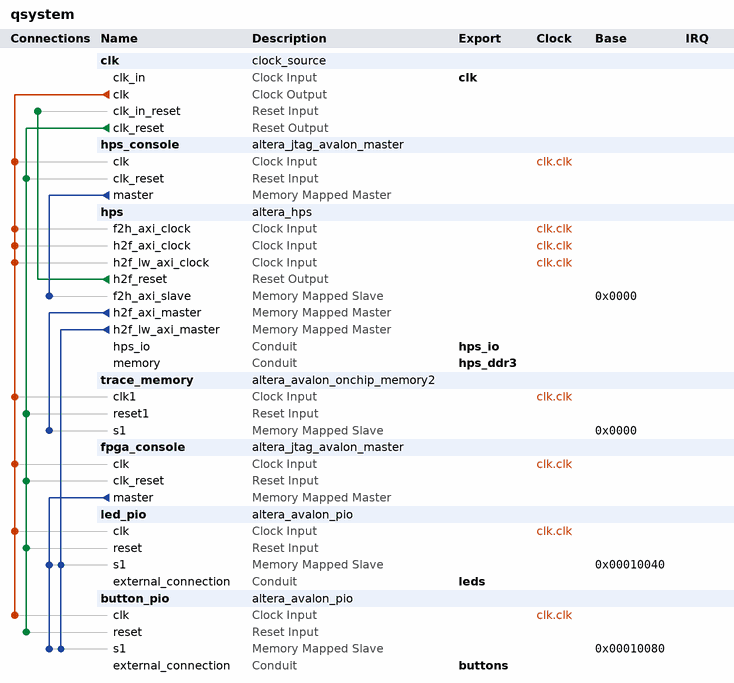
[diagram p0: system contents]
# Platform Designer (Qsys) system qsystem, Cyclone V 5CSXFC6C6U23C8ES
# Parameters at their usual value, and those the tool derives, are not listed.
package require -exact qsys 13.1
create_system qsystem
set_project_property DEVICE_FAMILY {Cyclone V}
set_project_property DEVICE 5CSXFC6C6U23C8ES

add_instance clk clock_source 13.1
set_instance_parameter_value clk clockFrequency 100000000

add_instance hps_console altera_jtag_avalon_master 13.1

add_instance hps altera_hps 13.1
set_instance_parameter_value hps MEM_VENDOR Micron
set_instance_parameter_value hps MEM_ROW_ADDR_WIDTH 15
set_instance_parameter_value hps MEM_COL_ADDR_WIDTH 10
set_instance_parameter_value hps MEM_DQ_WIDTH 32
set_instance_parameter_value hps MEM_BANKADDR_WIDTH 3
set_instance_parameter_value hps MEM_DRV_STR RZQ/6
set_instance_parameter_value hps MEM_RTT_NOM RZQ/4
set_instance_parameter_value hps MEM_RTT_WR {Dynamic ODT off}
set_instance_parameter_value hps MEM_WTCL 6
set_instance_parameter_value hps MEM_TCL 7
set_instance_parameter_value hps TIMING_TIS 170
set_instance_parameter_value hps TIMING_TIH 120
set_instance_parameter_value hps TIMING_TDS 10
set_instance_parameter_value hps TIMING_TDH 45
set_instance_parameter_value hps TIMING_TDQSQ 100
set_instance_parameter_value hps TIMING_TDQSCK 255
set_instance_parameter_value hps TIMING_TDQSS 0.27
set_instance_parameter_value hps TIMING_TQSH 0.45
set_instance_parameter_value hps TIMING_TDSH 0.18
set_instance_parameter_value hps TIMING_TDSS 0.18
set_instance_parameter_value hps MEM_TRAS_NS 35.0
set_instance_parameter_value hps MEM_TRCD_NS 13.75
set_instance_parameter_value hps MEM_TRP_NS 13.75
set_instance_parameter_value hps MEM_TRFC_NS 260.0
set_instance_parameter_value hps MEM_TFAW_NS 30.0
set_instance_parameter_value hps MEM_TRRD_NS 10.0
set_instance_parameter_value hps MEM_TRTP_NS 10.0
set_instance_parameter_value hps REF_CLK_FREQ 25.0
set_instance_parameter_value hps DEFAULT_FAST_SIM_MODEL true
set_instance_parameter_value hps TIMING_BOARD_MAX_CK_DELAY 0.6
set_instance_parameter_value hps TIMING_BOARD_MAX_DQS_DELAY 0.6
set_instance_parameter_value hps TIMING_BOARD_SKEW_CKDQS_DIMM_MIN -0.01
set_instance_parameter_value hps TIMING_BOARD_SKEW_CKDQS_DIMM_MAX 0.01
set_instance_parameter_value hps TIMING_BOARD_SKEW_WITHIN_DQS 0.02
set_instance_parameter_value hps TIMING_BOARD_SKEW_BETWEEN_DQS 0.02
set_instance_parameter_value hps TIMING_BOARD_DQ_TO_DQS_SKEW 0.0
set_instance_parameter_value hps TIMING_BOARD_AC_SKEW 0.02
set_instance_parameter_value hps TIMING_BOARD_AC_TO_CK_SKEW 0.0
set_instance_parameter_value hps MEM_CLK_FREQ 400.0
set_instance_parameter_value hps HPS_PROTOCOL DDR3
set_instance_parameter_value hps STM_Enable false
set_instance_parameter_value hps F2S_Width 2
set_instance_parameter_value hps S2F_Width 2
set_instance_parameter_value hps LWH2F_Enable true
set_instance_parameter_value hps F2SCLK_DBGRST_Enable false
set_instance_parameter_value hps F2SCLK_WARMRST_Enable false
set_instance_parameter_value hps F2SCLK_COLDRST_Enable false
set_instance_parameter_value hps F2SINTERRUPT_Enable false
set_instance_parameter_value hps EMAC1_PinMuxing {HPS I/O Set 0}
set_instance_parameter_value hps EMAC1_Mode RGMII
set_instance_parameter_value hps QSPI_PinMuxing Unused
set_instance_parameter_value hps QSPI_Mode N/A
set_instance_parameter_value hps SDIO_PinMuxing {HPS I/O Set 0}
set_instance_parameter_value hps SDIO_Mode {4-bit Data}
set_instance_parameter_value hps USB1_PinMuxing Unused
set_instance_parameter_value hps USB1_Mode N/A
set_instance_parameter_value hps SPIM1_PinMuxing Unused
set_instance_parameter_value hps SPIM1_Mode N/A
set_instance_parameter_value hps UART0_PinMuxing {HPS I/O Set 1}
set_instance_parameter_value hps UART0_Mode {No Flow Control}
set_instance_parameter_value hps I2C0_PinMuxing Unused
set_instance_parameter_value hps I2C0_Mode N/A
set_instance_parameter_value hps I2C1_PinMuxing Unused
set_instance_parameter_value hps I2C1_Mode N/A
set_instance_parameter_value hps TRACE_PinMuxing {HPS I/O Set 0}
set_instance_parameter_value hps TRACE_Mode HPS
set_instance_parameter_value hps S2FCLK_USER1CLK_FREQ 100
set_instance_parameter_value hps FPGA_PERIPHERAL_OUTPUT_CLOCK_FREQ_EMAC0_MD_CLK 100
set_instance_parameter_value hps FPGA_PERIPHERAL_OUTPUT_CLOCK_FREQ_EMAC0_GTX_CLK 100
set_instance_parameter_value hps FPGA_PERIPHERAL_OUTPUT_CLOCK_FREQ_EMAC1_MD_CLK 100
set_instance_parameter_value hps FPGA_PERIPHERAL_OUTPUT_CLOCK_FREQ_EMAC1_GTX_CLK 100

add_instance trace_memory altera_avalon_onchip_memory2 13.1
set_instance_parameter_value trace_memory dataWidth 32
set_instance_parameter_value trace_memory dualPort false
set_instance_parameter_value trace_memory initMemContent true
set_instance_parameter_value trace_memory initializationFileName onchip_mem.hex
set_instance_parameter_value trace_memory memorySize 65536

add_instance fpga_console altera_jtag_avalon_master 13.1

add_instance led_pio altera_avalon_pio 13.1
set_instance_parameter_value led_pio direction Output
set_instance_parameter_value led_pio width 4

add_instance button_pio altera_avalon_pio 13.1
set_instance_parameter_value button_pio direction Input
set_instance_parameter_value button_pio width 3

# connections
add_connection clk.clk button_pio.clk clock
add_connection clk.clk fpga_console.clk clock
add_connection clk.clk hps.f2h_axi_clock clock
add_connection clk.clk hps.h2f_axi_clock clock
add_connection clk.clk hps.h2f_lw_axi_clock clock
add_connection clk.clk hps_console.clk clock
add_connection clk.clk led_pio.clk clock
add_connection clk.clk trace_memory.clk1 clock
add_connection clk.clk_reset button_pio.reset reset
add_connection clk.clk_reset fpga_console.clk_reset reset
add_connection clk.clk_reset hps_console.clk_reset reset
add_connection clk.clk_reset led_pio.reset reset
add_connection clk.clk_reset trace_memory.reset1 reset
add_connection hps.h2f_reset clk.clk_in_reset reset
add_connection fpga_console.master button_pio.s1 avalon
set_connection_parameter_value fpga_console.master/button_pio.s1 baseAddress 0x00010080
add_connection fpga_console.master led_pio.s1 avalon
set_connection_parameter_value fpga_console.master/led_pio.s1 baseAddress 0x00010040
add_connection hps.h2f_axi_master trace_memory.s1 avalon
set_connection_parameter_value hps.h2f_axi_master/trace_memory.s1 baseAddress 0x0000
add_connection hps.h2f_lw_axi_master button_pio.s1 avalon
set_connection_parameter_value hps.h2f_lw_axi_master/button_pio.s1 baseAddress 0x00010080
add_connection hps.h2f_lw_axi_master led_pio.s1 avalon
set_connection_parameter_value hps.h2f_lw_axi_master/led_pio.s1 baseAddress 0x00010040
add_connection hps_console.master hps.f2h_axi_slave avalon
set_connection_parameter_value hps_console.master/hps.f2h_axi_slave baseAddress 0x0000

# exported interfaces
add_interface clk clock sink
set_interface_property clk EXPORT_OF clk.clk_in
add_interface leds conduit end
set_interface_property leds EXPORT_OF led_pio.external_connection
add_interface buttons conduit end
set_interface_property buttons EXPORT_OF button_pio.external_connection
add_interface hps_io conduit end
set_interface_property hps_io EXPORT_OF hps.hps_io
add_interface hps_ddr3 conduit end
set_interface_property hps_ddr3 EXPORT_OF hps.memory

set_interconnect_requirement {$system} qsys_mm.clockCrossingAdapter HANDSHAKE
set_interconnect_requirement {$system} qsys_mm.maxAdditionalLatency 1
set_interconnect_requirement {$system} qsys_mm.insertDefaultSlave false

save_system qsystem.qsys
